# EAGLE design 5MMHexaStellaBreakout (EAGLE 6.5.0)
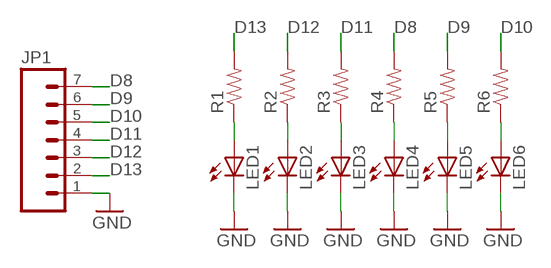
[diagram p0: schematic, sheet 1]

## Parts
JP1  M07  [1X07]
LED1  LED5MM  [LED5MM]
LED2  LED5MM  [LED5MM]
LED3  LED5MM  [LED5MM]
LED4  LED5MM  [LED5MM]
LED5  LED5MM  [LED5MM]
LED6  LED5MM  [LED5MM]
R1  RESISTORAXIAL-0.3  [AXIAL-0.3]
R2  RESISTORAXIAL-0.3  [AXIAL-0.3]
R3  RESISTORAXIAL-0.3  [AXIAL-0.3]
R4  RESISTORAXIAL-0.3  [AXIAL-0.3]
R5  RESISTORAXIAL-0.3  [AXIAL-0.3]
R6  RESISTORAXIAL-0.3  [AXIAL-0.3]

## Nets
D8: JP1.7 R4.P$2
D9: JP1.6 R5.P$2
D10: JP1.5 R6.P$2
D11: JP1.4 R3.P$2
D12: JP1.3 R2.P$2
D13: JP1.2 R1.P$2
GND: JP1.1 LED1.K(C) LED2.K(C) LED3.K(C) LED4.K(C) LED5.K(C) LED6.K(C)
N$1: LED1.A R1.P$1
N$2: LED4.A R4.P$1
N$3: LED2.A R2.P$1
N$4: LED5.A R5.P$1
N$5: LED3.A R3.P$1
N$6: LED6.A R6.P$1

## Library data of the parts
JP1 = SparkFun-Connectors:M07: Header 7 Standard 7-pin 0.1" header. Use with straight break away headers (SKU : PRT-00116), right angle break away headers (PRT-00553), swiss pins (PRT-00743), machine pins (PRT-00117), and female headers (PRT-00115). NOTES ON THE VARIANTS LOCK and LOCK_LONGPADS... This footprint was designed to help hold the alignment of a through-hole component (i.e. 7-pin header) while soldering it into place. You may notice that each hole has been shifted either up or down by 0.005 of an inch from it's more standard position (which is usually a perfectly straight line). This slight alteration caused the pins (the squares in the middle) to touch the edges of the holes. Because they are alternating, it causes a "brace" to hold the header in place. 0.005 has proven to be the perfect amount of "off-center" position when using our standard breakaway headers. Although looks a little odd when you look at the bare footprint, once you have a header in there, the alteration is very hard to notice. Also, if you push a header all the way into place, it is covered up entirely on the bottom side. This idea of altering the position of holes to aid alignment will be further integrated into the Sparkfun Library for other footprints. It can help hold any component with 3 or more connection pins.
LED1-LED6 = barbary_enterprises:LED: LEDs Standard schematic elements and footprints for 5mm, 3mm, 1206, and 0603 sized LEDs. 5mm - Spark Fun Electronics SKU : COM-00529 (and others)
R1-R6 = barbary_enterprises:RESISTOR: Resistor Basic schematic elements and footprints for 0603, 1206, and PTH resistors.

## Board
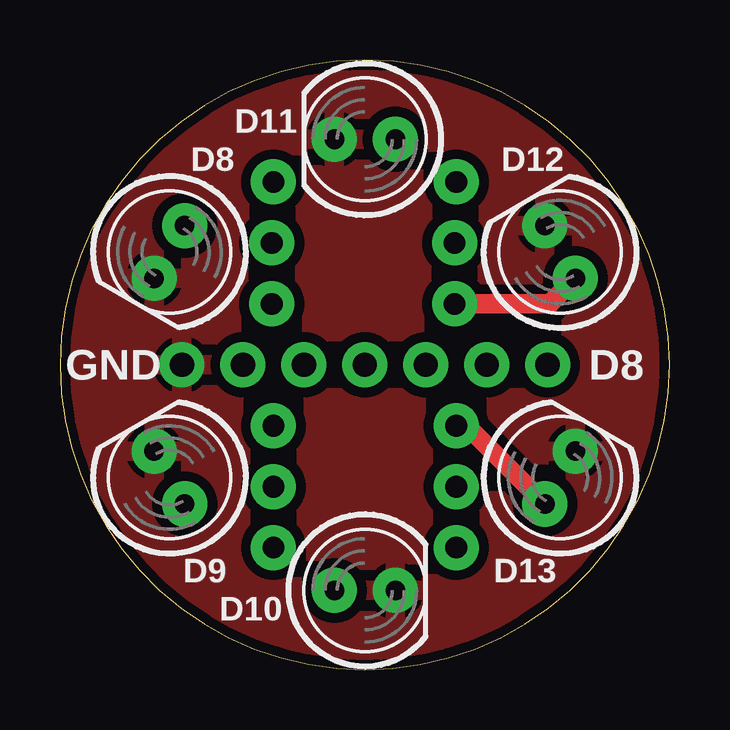
[diagram p1: board, top side]
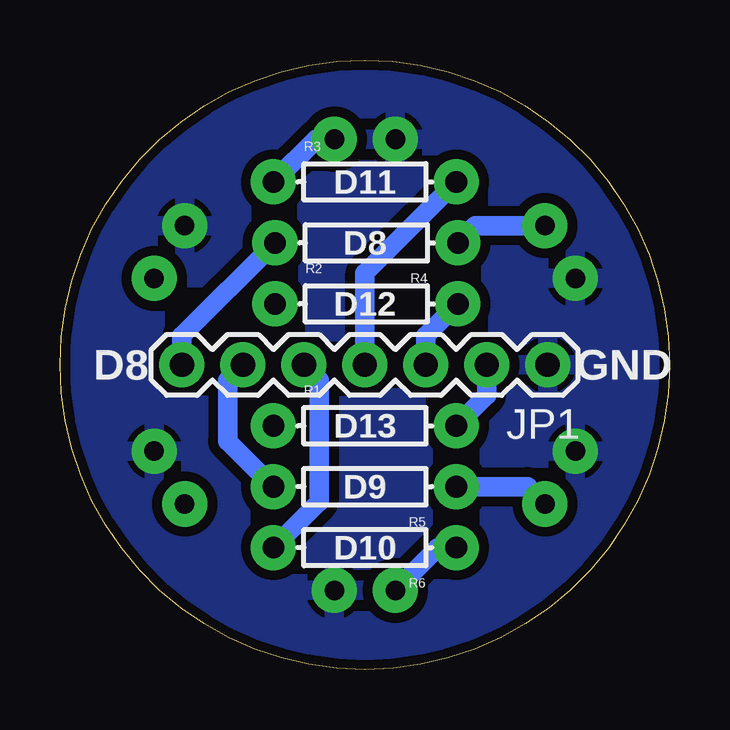
[diagram p2: board, bottom side, seen from below]

Size 25.4 x 25.4 mm. Coordinates in mm from the lower left corner, seen from the top.
Outline: 0,12.7 arc90 12.7,0 arc90 25.4,12.7 arc90 12.7,25.4 arc90 0,12.7
Copper layers (1*16): Top 0.0356mm / dielectric 1.5011mm / Bottom 0.0356mm
Design rules "LaenPCBOrder": minimum track width 6mil, minimum drill 13mil, track to track 6mil, track to pad 6mil, pad to pad 6mil, via to via 6mil, smd to smd 6mil, copper to edge 15mil, drill to drill 6mil, minimum pad ring 7mil, minimum via ring 7mil, stop-mask expansion 3mil, vias tented up to drill 0mil, thermal gap 10mil

### Footprints (pad centres in the part's own frame; a part is rotated, then mirrored left to right if it is on the bottom)
1X07 = drill 1.016 pad 1.88: 1 0,0; 2 2.54,0; 3 5.08,0; 4 7.62,0; 5 10.16,0; 6 12.7,0; 7 15.24,0
LED5MM = drill 0.813 pad 1.88: A -1.27,0; K 1.27,0
AXIAL-0.3 = drill 0.9 pad 1.88: P$1 -3.81,0; P$2 3.81,0

### Placement (x,y rotation side)
JP1  5.08,12.7 180 bottom
LED1  20.84,8 60 top
LED2  20.84,17.4 120 top
LED3  12.7,22.1 180 top
LED4  4.56,17.4 240 top
LED5  4.56,8 120 top
LED6  12.7,3.3 0 top
R1  12.7,10.16 0 bottom
R2  12.63,15.24 0 bottom
R3  12.7,20.32 0 bottom
R4  12.63,17.78 180 bottom
R5  12.7,7.62 180 bottom
R6  12.7,5.08 180 bottom

### Tracks (layer width: path | path; a pad name or v marks a point on that pad's centre or on a via)
D8
  Bottom 0.813: JP1.7 20.32,13.9 R4.P$2
D9
  Bottom 0.813: JP1.6 18.41,12.06 18.41,9.53 R5.P$2
D10
  Bottom 0.813: JP1.5 14.61,12.06 14.61,6.99 R6.P$2
D11
  Bottom 0.813: JP1.4 12.7,16.51 R3.P$2
D12
  Bottom 0.813: JP1.3 10.16,13.9 R2.P$2
D13
  Bottom 0.813: JP1.2 7.62,11.43 R1.P$2
GND
  pour Bottom (isolate 0.406): 0,0 25.4,0 25.4,25.4 0,25.4
  pour Top (isolate 0.406): 0,0 25.4,0 25.4,25.4 0,25.4
N$1
  Top 0.813: R1.P$1 16.95,10.16 LED1.A
N$2
  Bottom 0.813: LED4.A 8.1,18.5 R4.P$1
N$3
  Top 0.813: R2.P$1 20.41,15.24 LED2.A
N$4
  Bottom 0.813: R5.P$1 5.92,7.62 LED5.A
N$5
  Bottom 0.813: LED3.A 14.73,22.1 R3.P$1
N$6
  Bottom 0.813: R6.P$1 9.65,5.08 LED6.A

### Text on the board
tPlace: D11 | D8 | D12 | GND | D8 | D9 | D13 | D10
bPlace: D11 | D8 | D12 | GND | D8 | D13 | D9 | D10